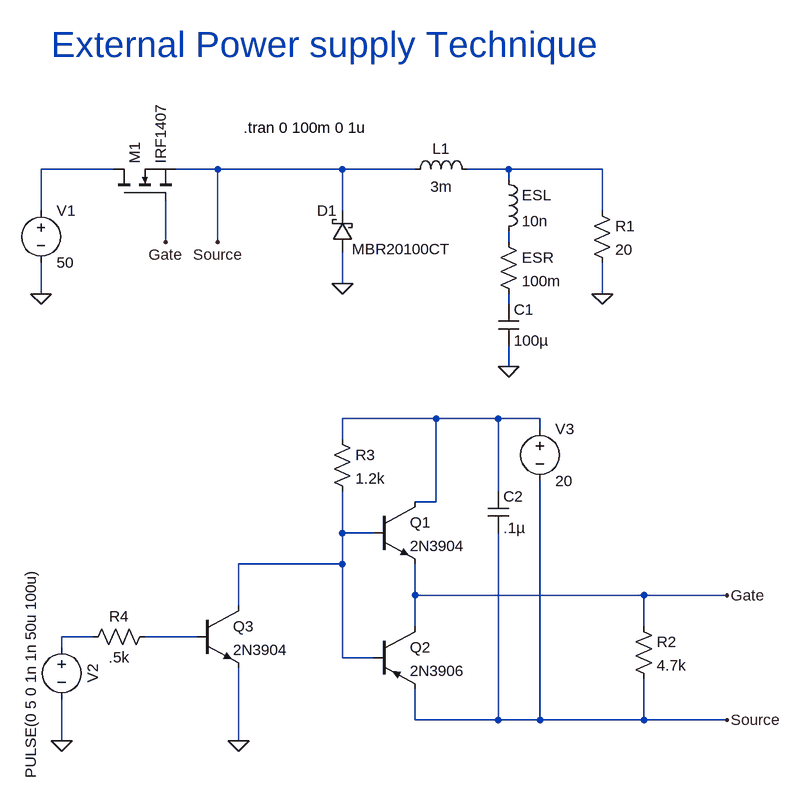
[diagram p0: schematic 03-buckConverterPushPull.asc]
03-buckConverterPushPull.asc, the LTspice schematic file:
Version 4
SHEET 1 884 1020
WIRE -752 64 -864 64
WIRE -592 64 -656 64
WIRE -400 64 -592 64
WIRE -288 64 -400 64
WIRE -144 64 -208 64
WIRE 0 64 -144 64
WIRE -144 80 -144 64
WIRE -864 128 -864 64
WIRE -400 128 -400 64
WIRE 0 128 0 64
WIRE -672 176 -672 112
WIRE -592 176 -592 64
WIRE -144 176 -144 160
WIRE -400 240 -400 192
WIRE -864 256 -864 208
WIRE 0 256 0 208
WIRE -144 272 -144 256
WIRE -144 368 -144 336
WIRE -256 448 -400 448
WIRE -160 448 -256 448
WIRE -96 448 -160 448
WIRE -96 464 -96 448
WIRE -400 480 -400 448
WIRE -160 560 -160 448
WIRE -256 576 -256 448
WIRE -256 576 -288 576
WIRE -400 624 -400 560
WIRE -352 624 -400 624
WIRE -400 672 -400 624
WIRE -400 672 -560 672
WIRE -288 720 -288 672
WIRE 64 720 -288 720
WIRE 192 720 64 720
WIRE -560 736 -560 672
WIRE -288 768 -288 720
WIRE 64 768 64 720
WIRE -784 784 -832 784
WIRE -624 784 -704 784
WIRE -832 800 -832 784
WIRE -400 816 -400 672
WIRE -352 816 -400 816
WIRE -288 912 -288 864
WIRE -160 912 -160 624
WIRE -160 912 -288 912
WIRE -96 912 -96 544
WIRE -96 912 -160 912
WIRE 64 912 64 848
WIRE 64 912 -96 912
WIRE 192 912 64 912
WIRE -832 944 -832 880
WIRE -560 944 -560 832
FLAG -400 240 0
FLAG -144 368 0
FLAG 0 256 0
FLAG -864 256 0
FLAG -832 944 0
FLAG -560 944 0
FLAG -672 176 Gate
FLAG -592 176 Source
FLAG 192 720 Gate
FLAG 192 912 Source
SYMBOL schottky -384 192 R180
WINDOW 0 24 64 Left 2
WINDOW 3 -152 5 Left 2
SYMATTR InstName D1
SYMATTR Value MBR20100CT
SYMATTR Description Diode
SYMATTR Type diode
SYMBOL voltage -864 112 R0
WINDOW 123 0 0 Left 0
WINDOW 39 0 0 Left 0
SYMATTR InstName V1
SYMATTR Value 50
SYMBOL ind -304 80 R270
WINDOW 0 32 56 VTop 2
WINDOW 3 5 56 VBottom 2
SYMATTR InstName L1
SYMATTR Value 3m
SYMBOL cap -160 272 R0
SYMATTR InstName C1
SYMATTR Value 100µ
SYMBOL res -16 112 R0
SYMATTR InstName R1
SYMATTR Value 20
SYMBOL nmos -752 112 R270
SYMATTR InstName M1
SYMATTR Value IRF1407
SYMBOL voltage -832 784 R0
WINDOW 0 32 56 VTop 2
WINDOW 3 -32 56 VBottom 2
WINDOW 123 0 0 Left 0
WINDOW 39 0 0 Left 0
SYMATTR InstName V2
SYMATTR Value PULSE(0 5 0 1n 1n 50u 100u)
SYMBOL res -160 160 R0
SYMATTR InstName ESR
SYMATTR Value 100m
SYMBOL ind -160 64 R0
SYMATTR InstName ESL
SYMATTR Value 10n
SYMBOL npn -352 576 R0
SYMATTR InstName Q1
SYMATTR Value 2N3904
SYMBOL pnp -352 768 R0
SYMATTR InstName Q2
SYMATTR Value 2N3906
SYMBOL res -416 464 R0
SYMATTR InstName R3
SYMATTR Value 1.2k
SYMBOL res -688 768 R90
WINDOW 0 0 56 VBottom 2
WINDOW 3 32 56 VTop 2
SYMATTR InstName R4
SYMATTR Value .5k
SYMBOL npn -624 736 R0
SYMATTR InstName Q3
SYMATTR Value 2N3904
SYMBOL voltage -96 448 R0
WINDOW 123 0 0 Left 0
WINDOW 39 0 0 Left 0
SYMATTR InstName V3
SYMATTR Value 20
SYMBOL cap -176 560 R0
SYMATTR InstName C2
SYMATTR Value .1µ
SYMBOL res 48 752 R0
SYMATTR InstName R2
SYMATTR Value 4.7k
TEXT -552 0 Left 2 !.tran 0 100m 0 1u
TEXT -848 -128 Left 5 ;External Power supply Technique

The netlist it stands for:
* 03-buckConverterPushPull.asc
D1 0 Source MBR20100CT
V1 N001 0 50
L1 Source N002 3m
C1 N004 0 100µ
R1 N002 0 20
M1 N001 Gate Source Source IRF1407
V2 N007 0 PULSE(0 5 0 1n 1n 50u 100u)
R§ESR N003 N004 100m
L§ESL N002 N003 10n
Q1 N005 N006 Gate 0 2N3904
Q2 Gate N006 Source 0 2N3906
R3 N005 N006 1.2k
R4 N008 N007 .5k
Q3 N006 N008 0 0 2N3904
V3 N005 Source 20
C2 N005 Source .1µ
R2 Gate Source 4.7k
.model D D
.lib standard.dio
.model NPN NPN
.model PNP PNP
.lib standard.bjt
.model NMOS NMOS
.model PMOS PMOS
.lib standard.mos
.tran 0 100m 0 1u
* External Power supply Technique
.backanno
.end